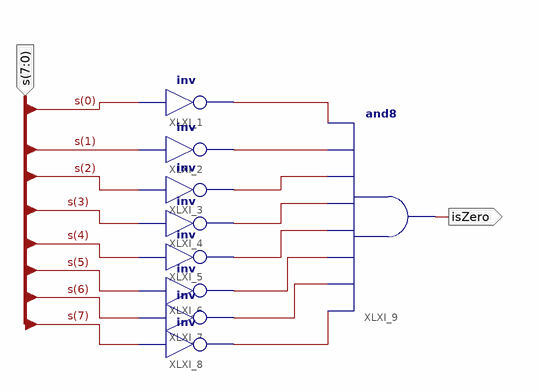
[diagram p0: schematic sheet 1]
// Xilinx ISE schematic isZero.sch (spartan3e) as structural Verilog: 9 symbols, 2 ports
module isZero (
  input  [7:0] s,
  output isZero
);

  wire XLXN_11, XLXN_12, XLXN_13, XLXN_14, XLXN_15, XLXN_16, XLXN_17, XLXN_18;

  not XLXI_1 (XLXN_11, s[0]);
  not XLXI_2 (XLXN_12, s[1]);
  not XLXI_3 (XLXN_13, s[2]);
  not XLXI_4 (XLXN_14, s[3]);
  not XLXI_5 (XLXN_15, s[4]);
  not XLXI_6 (XLXN_16, s[5]);
  not XLXI_7 (XLXN_17, s[6]);
  not XLXI_8 (XLXN_18, s[7]);
  and XLXI_9 (isZero, XLXN_18, XLXN_17, XLXN_16, XLXN_15, XLXN_14, XLXN_13, XLXN_12, XLXN_11);
endmodule
